# Altium schematic sheet 8.1 BEACON_DRIVER.SchDoc: 6.6kW Daul OBC +11kW WPT
size A3; Revision: V 1.0; SheetNumber: 9; SheetTotal: 14; ImagePath: 0
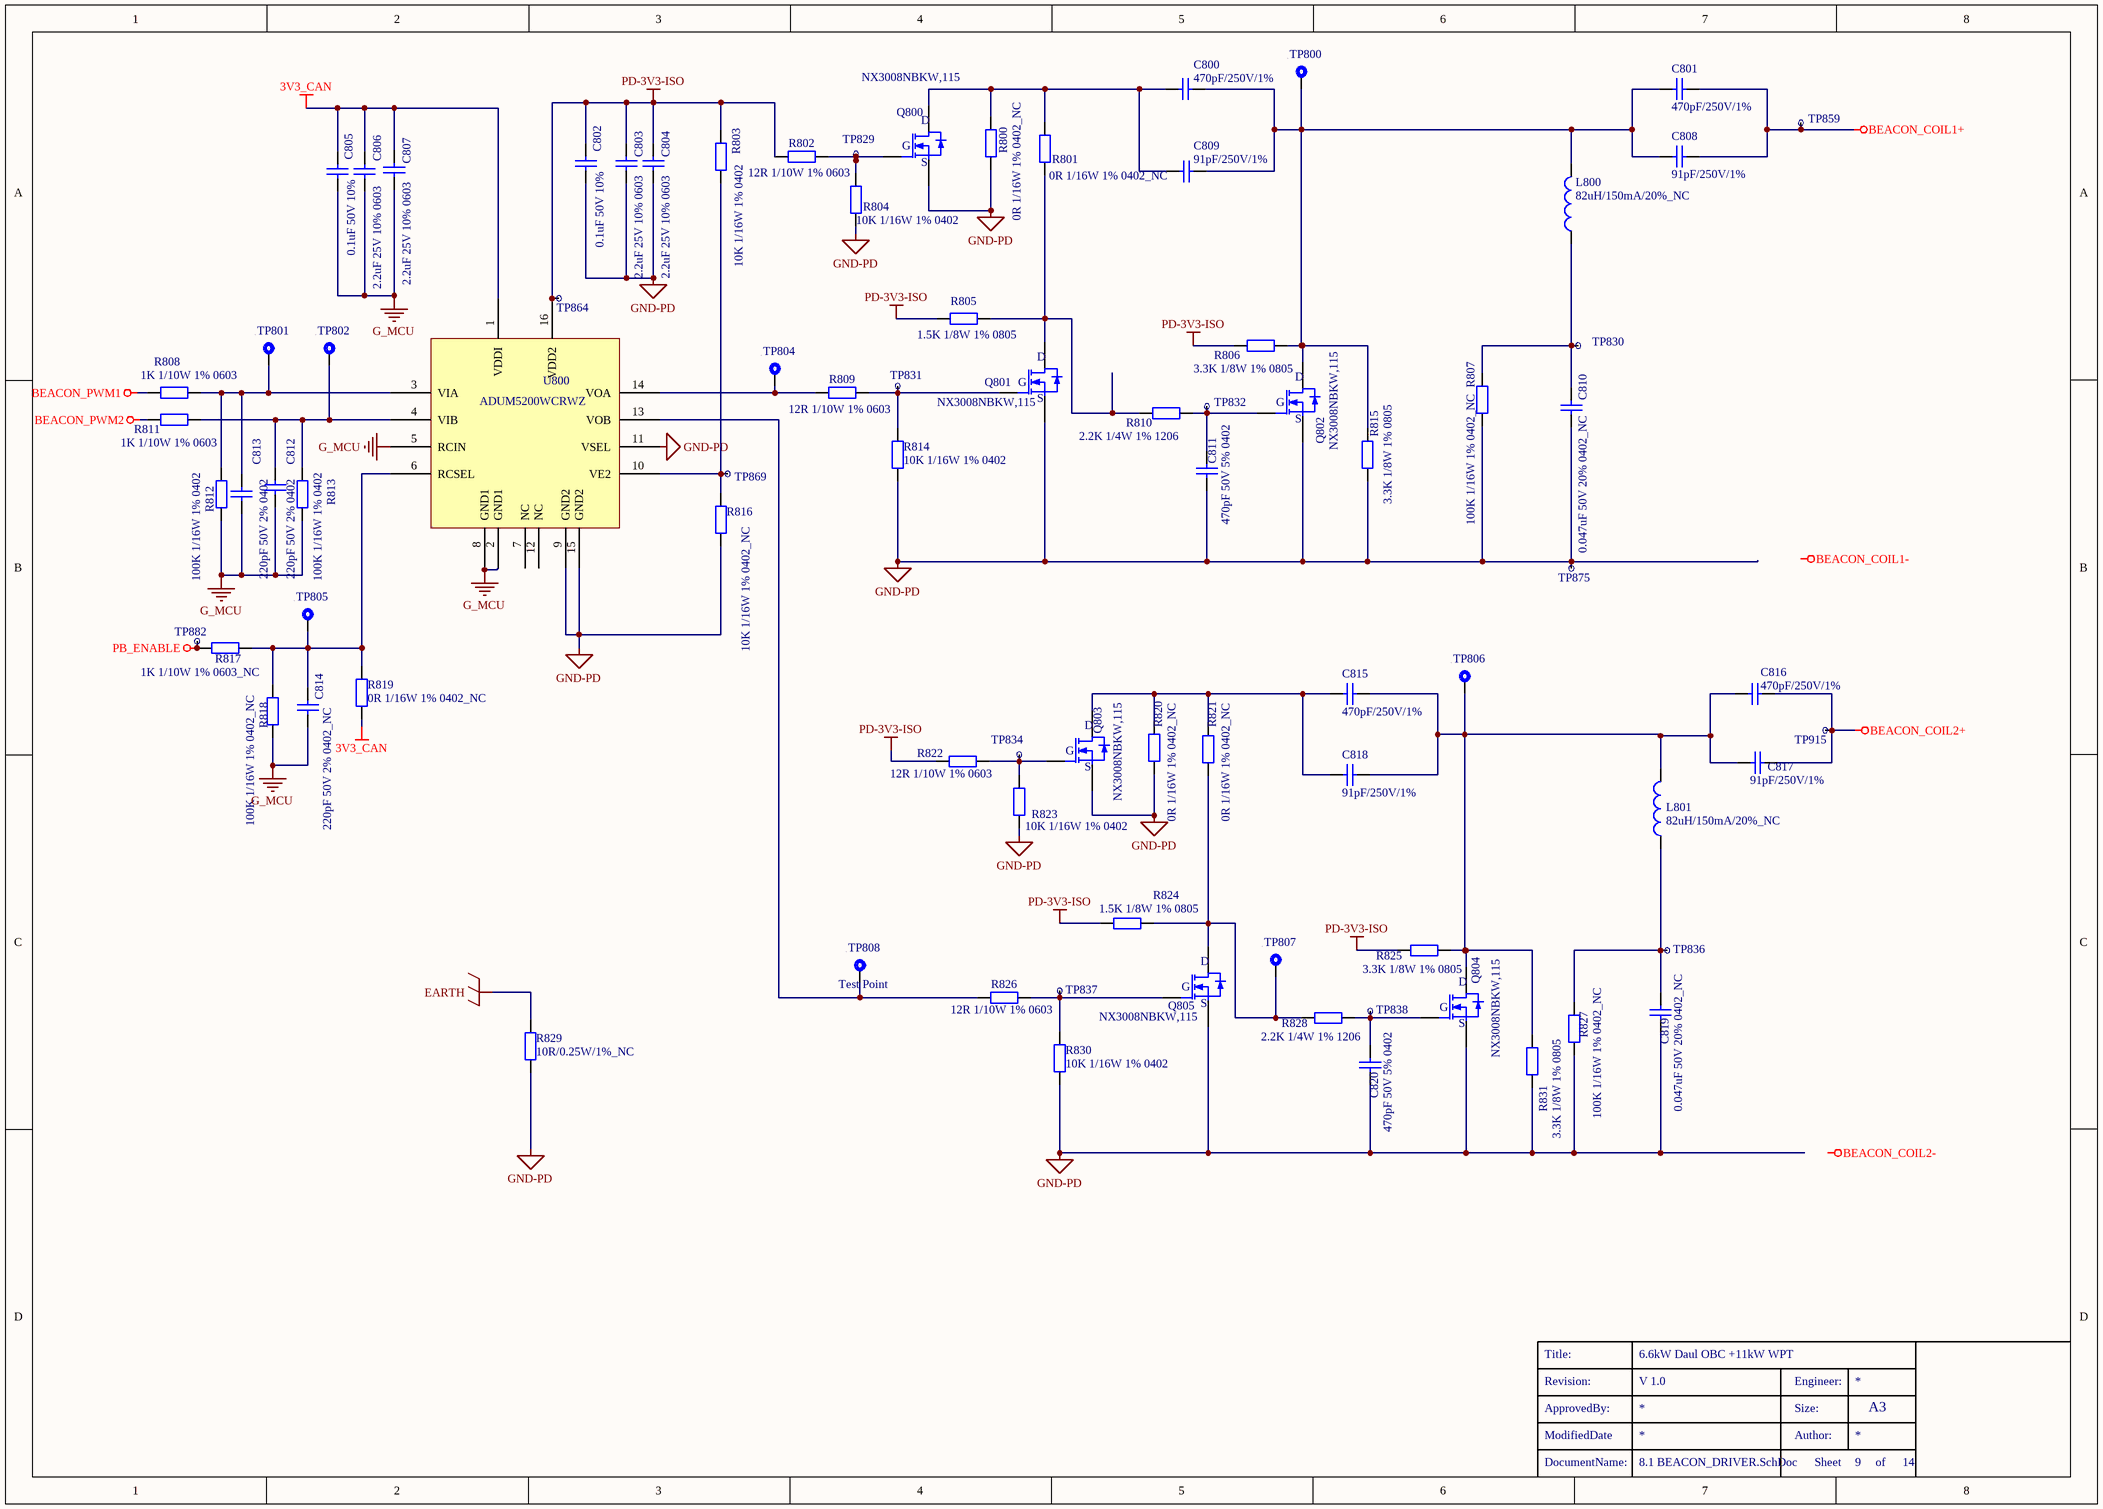
[diagram p0: 8.1 BEACON_DRIVER.SchDoc]

## Parts
C800  470pF/250V/1%  [C0603]
C801  470pF/250V/1%  [C0603]
C802  0.1uF 50V 10%  [C0603]
C803  2.2uF 25V 10% 0603  [C0603]
C804  2.2uF 25V 10% 0603  [C0603]
C805  0.1uF 50V 10%  [C0603]
C806  2.2uF 25V 10% 0603  [C0603]
C807  2.2uF 25V 10% 0603  [C0603]
C808  91pF/250V/1%  [C0603]
C809  91pF/250V/1%  [C0603]
C810  0.047uF 50V 20% 0402_NC  [C0402]
C811  470pF 50V 5% 0402  [C0402]
C812  220pF 50V 2% 0402  [C0402]
C813  220pF 50V 2% 0402  [C0402]
C814  220pF 50V 2% 0402_NC  [C0402]
C815  470pF/250V/1%  [C0603]
C816  470pF/250V/1%  [C0603]
C817  91pF/250V/1%  [C0603]
C818  91pF/250V/1%  [C0603]
C819  0.047uF 50V 20% 0402_NC  [C0402]
C820  470pF 50V 5% 0402  [C0402]
L800  82uH/150mA/20%_NC  [L2X1.6_0806]
L801  82uH/150mA/20%_NC  [L2X1.6_0806]
Q800  NX3008NBKW,115  [SOT323]
Q801  NX3008NBKW,115  [SOT323]
Q802  NX3008NBKW,115  [SOT323]
Q803  NX3008NBKW,115  [SOT323]
Q804  NX3008NBKW,115  [SOT323]
Q805  NX3008NBKW,115  [SOT323]
R800  0R 1/16W 1% 0402_NC  [R0402]
R801  0R 1/16W 1% 0402_NC  [R0402]
R802  12R 1/10W 1% 0603  [R0603]
R803  10K 1/16W 1% 0402  [R0402]
R804  10K 1/16W 1% 0402  [R0402]
R805  1.5K 1/8W 1% 0805  [R0805]
R806  3.3K 1/8W 1% 0805  [R0805]
R807  100K 1/16W 1% 0402_NC  [R0402]
R808  1K 1/10W 1% 0603  [R0603]
R809  12R 1/10W 1% 0603  [R0603]
R810  2.2K 1/4W 1% 1206  [R1206]
R811  1K 1/10W 1% 0603  [R0603]
R812  100K 1/16W 1% 0402  [R0402]
R813  100K 1/16W 1% 0402  [R0402]
R814  10K 1/16W 1% 0402  [R0402]
R815  3.3K 1/8W 1% 0805  [R0805]
R816  10K 1/16W 1% 0402_NC  [R0402]
R817  1K 1/10W 1% 0603_NC  [R0603]
R818  100K 1/16W 1% 0402_NC  [R0402]
R819  0R 1/16W 1% 0402_NC  [R0402]
R820  0R 1/16W 1% 0402_NC  [R0402]
R821  0R 1/16W 1% 0402_NC  [R0402]
R822  12R 1/10W 1% 0603  [R0603]
R823  10K 1/16W 1% 0402  [R0402]
R824  1.5K 1/8W 1% 0805  [R0805]
R825  3.3K 1/8W 1% 0805  [R0805]
R826  12R 1/10W 1% 0603  [R0603]
R827  100K 1/16W 1% 0402_NC  [R0402]
R828  2.2K 1/4W 1% 1206  [R1206]
R829  10R/0.25W/1%_NC  [R1206]
R830  10K 1/16W 1% 0402  [R0402]
R831  3.3K 1/8W 1% 0805  [R0805]
TP800  Test Point  [测试点]  (value not drawn)
TP801  Test Point  [测试点]  (value not drawn)
TP802  Test Point  [测试点]  (value not drawn)
TP804  Test Point  [测试点]  (value not drawn)
TP805  Test Point  [测试点]  (value not drawn)
TP806  Test Point  [测试点]  (value not drawn)
TP807  Test Point  [测试点]  (value not drawn)
TP808  Test Point  [测试点]
TP829  测试点  [测试点]  (value not drawn)
TP830  测试点  [测试点]  (value not drawn)
TP831  测试点  [测试点]  (value not drawn)
TP832  测试点  [测试点]  (value not drawn)
TP834  测试点  [测试点]  (value not drawn)
TP836  测试点  [测试点]  (value not drawn)
TP837  测试点  [测试点]  (value not drawn)
TP838  测试点  [测试点]  (value not drawn)
TP859  测试点  [测试点]  (value not drawn)
TP864  测试点  [测试点]  (value not drawn)
TP869  测试点  [测试点]  (value not drawn)
TP875  测试点  [测试点]  (value not drawn)
TP882  测试点  [测试点]  (value not drawn)
TP915  测试点  [测试点]  (value not drawn)
U800  ADUM5200WCRWZ  [SOIC-16_L10.3-W7.5-P1.27-LS10.3-BL]

## Nets
3V3_CAN: C805.2 C806.2 C807.2 R819.2 U800.1(VDDI)
BEACON_COIL1+: C801.1 C808.1 TP859.1
BEACON_COIL2+: C816.1 C817.1 TP915.1
BEACON_PWM1: R808.1
BEACON_PWM2: R811.1
EARTH: R829.1
G_MCU: C805.1 C806.1 C807.1 C812.2 C813.2 C814.2 R812.1 R813.1 R818.1 U800.2(GND1) U800.5(RCIN) U800.8(GND1)
GND-PD: C802.1 C803.1 C804.1 C810.2 C811.2 C819.2 C820.2 Q800.S Q801.S Q802.S Q803.S Q804.S Q805.S R800.2 R804.1 R807.1 R814.1 R815.1 R816.1 R820.2 R823.1 R827.1 R829.2 R830.1 R831.1 TP875.1 U800.9(GND2) U800.11(VSEL) U800.15(GND2)
PB_ENABLE: R817.1 TP882.1
PD-3V3-ISO: C802.2 C803.2 C804.2 R802.2 R803.2 R805.2 R806.2 R822.2 R824.2 R825.2 TP864.1 U800.16(VDD2)
NetC800_1: C800.1 C801.2 C808.2 C809.1 L800.2 Q802.D R806.1 R815.2 TP800.1
NetC800_2: C800.2 C809.2 Q800.D R800.1 R801.1
NetC810_1: C810.1 L800.1 R807.2 TP830.1
NetC811_1: C811.1 Q802.G R810.1 TP832.1
NetC812_1: C812.1 R811.2 R813.2 TP802.1 U800.4(VIB)
NetC813_1: C813.1 R808.2 R812.2 TP801.1 U800.3(VIA)
NetC814_1: C814.1 R817.2 R818.2 R819.1 TP805.1 U800.6(RCSEL)
NetC815_1: C815.1 C816.2 C817.2 C818.1 L801.2 Q804.D R825.1 R831.2 TP806.1
NetC815_2: C815.2 C818.2 Q803.D R820.1 R821.1
NetC819_1: C819.1 L801.1 R827.2 TP836.1
NetC820_1: C820.1 Q804.G R828.1 TP838.1
NetQ800_G: Q800.G R802.1 R804.2 TP829.1
NetQ801_D: Q801.D R801.2 R805.1 R810.2
NetQ801_G: Q801.G R809.1 R814.2 TP831.1
NetQ803_G: Q803.G R822.1 R823.2 TP834.1
NetQ805_D: Q805.D R821.2 R824.1 R828.2 TP807.1
NetQ805_G: Q805.G R826.1 R830.2 TP837.1
NetR803_1: R803.1 R816.2 TP869.1 U800.10(VE2)
NetR809_2: R809.2 TP804.1 U800.14(VOA)
NetR826_2: R826.2 TP808.1 U800.13(VOB)

Not connected (* = marked no-connect by the designer): U800 7(NC) 12(NC)

## Notes on the sheet
- Labels drawn without touching a wire or pin: BEACON_COIL1-, BEACON_COIL2-
- Revision:
- Title:
- Engineer:
- ModifiedDate
- ApprovedBy:
- Author:
- Size:
- A3
- DocumentName:
- Sheet
- of

## Library data of the parts
C800 C801 C815 C816 = Cap: CAP CER 470pF 250V 1% C0G/NP0 0603 SMD; 厂商: KEMET; 料号: C0603C471GAGAC7867
C802 C805 = Cap: CAP CER 0.1uF 50V 10% X7R 0603 SMD; 厂商: SAMSUNG; 料号: CL10B104KB8WPNC
C803 C804 C806 C807 = Cap Semi: CAP CER 2.2uF 25V 10% X5R 0603 SMD; 厂商: Samsung; 料号: CL10A225KA8NNNC
C808 C809 C817 C818 = Cap: CAP CER 91pF 250V 1% C0G/NP0 0603 SMD; 厂商: *; 料号: *
C810 C819 = Cap: CAP CER 0.047uF 50V 20% X7R 0402 SMD; 厂商: *; 料号: *
C811 C820 = Cap: CAP CER 470pF 50V 5% C0G/NP0 0402 SMD; 厂商: Taiyo; 料号: UMK105CG471JVHF
C812-C814 = Cap: CAP CER 220pF 50V 2% C0G/NPO 0402 SMD; 厂商: Murata; 料号: GCM1555C1H221GA16D
L800 L801 = Inductor: Inductor 82uH 150mA 20% SMD; 厂商: *; 料号: *
Q800-Q805 = MOSFET-N: MOSFET N-Channel 30V 350mA SOT-323-3; 厂商: Nexperia; 料号: NX3008NBKW,115
R800 R801 R819-R821 = Res2: RES Thick Film 0R 1/16W 1% 0402 SMD; 厂商: YAGEO; 料号: AC0402FR-070RL
R802 R809 R822 R826 = Res2: RES Thick Film 12R 1/10W 1% 0603 SMD; 厂商: YAGEO; 料号: AC0603FR-0712RL
R803 R804 R814 R816 R823 R830 = Res2: RES Thick Film 10K 1/16W 1% 0402 SMD; 厂商: YAGEO; 料号: AC0402FR-0710KL
R805 R824 = Res2: RES Thick Film 1.5K 1/8W 1% 0805 SMD; 厂商: TA-I; 料号: RMS10FT1501
R806 R815 R825 R831 = Res2: RES Thick Film 3.3K 1/8W 1% 0805 SMD; 厂商: TA-I; 料号: RMS10FT3301
R807 R812 R813 R818 R827 = Res2: RES 100K 1/16W 1% 0402 SMD; 厂商: TA-I; 料号: RMH04FT1003
R808 R811 R817 = Res2: RES Thick Film 1K 1/10W 1% 0603 SMD; 料号: RMS06FT1001; 厂商: TA-I
R810 R828 = Res2: RES Thick Film 2.2K 1/4W 1% 1206 SMD; 料号: RMS12FT2201; 厂商: TA-I
R829 = Res2: RES Thick Film 10R 1/4W 1% 1206 SMD; 厂商: TA-I; 料号: RMS12FT10R0
TP800-TP802 TP804-TP808 = Test Point: Test Point 1mm
U800 = ADUM5200WCRWZ: IC Digital Isolator Integrated DC-DC Dual-Channel 3V-5.5V 23mA SOIC-16; 厂商: ADI; 料号: ADUM5200WCRWZ